# Altium schematic sheet Digital Port L.SchDoc: Port L Digital Control
size A4
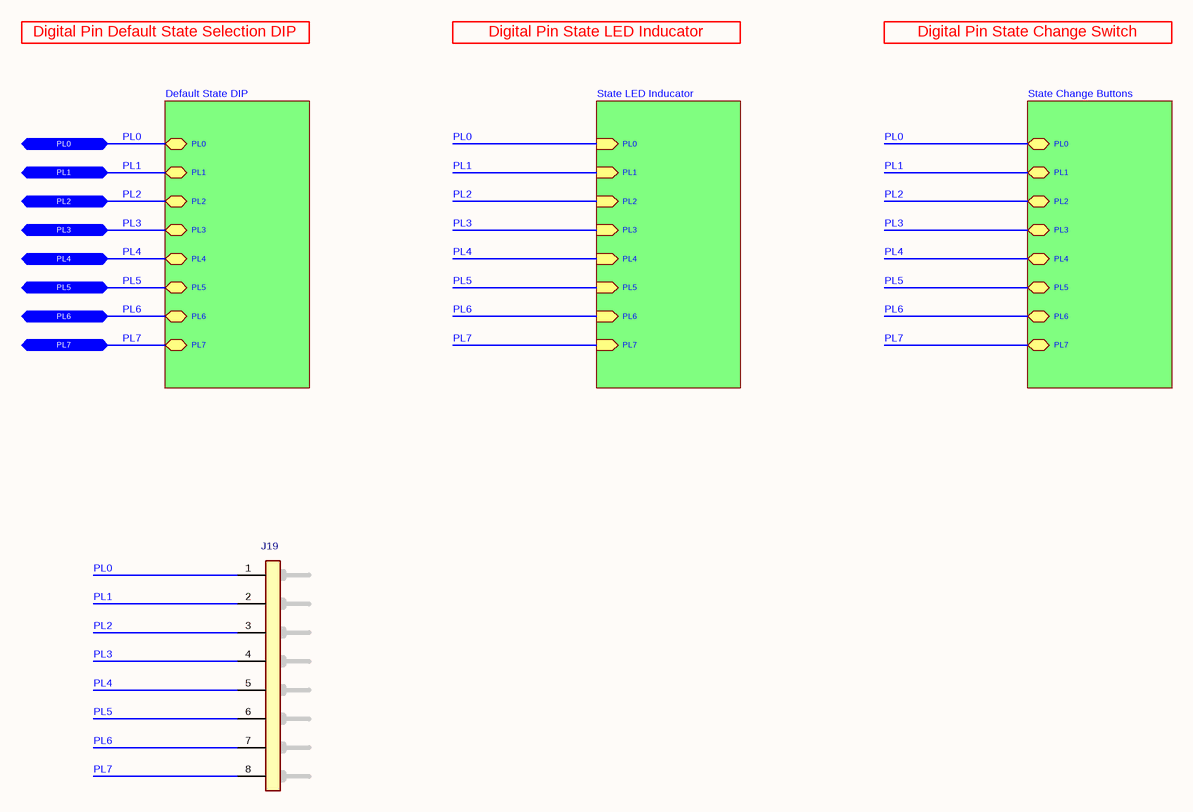
[diagram p0: Digital Port L.SchDoc]

## Parts
J19  2.54 mm Pitch 8P Male Connector  [8P Header]  (value not drawn)

## Sub-sheets
Default State DIP = Digital Port L Default State DIP.SchDoc: PL1 (bidir), PL0 (bidir), PL7 (bidir), PL4 (bidir), PL6 (bidir), PL3 (bidir), PL5 (bidir), PL2 (bidir)
State Change Buttons = Digital Port L Button.SchDoc: PL1 (bidir), PL0 (bidir), PL7 (bidir), PL4 (bidir), PL6 (bidir), PL3 (bidir), PL5 (bidir), PL2 (bidir)
State LED Inducator = Digital Port L State LED Inducator.SchDoc: PL1 (in), PL0 (in), PL7 (in), PL4 (in), PL6 (in), PL3 (in), PL5 (in), PL2 (in)

## Ports
PL0 (bidir), PL1 (bidir), PL2 (bidir), PL3 (bidir), PL4 (bidir), PL5 (bidir), PL6 (bidir), PL7 (bidir)

## Nets
PL0: J19.1(Pin-1) ; port PL0, sheet Default State DIP/PL0, sheet State LED Inducator/PL0, sheet State Change Buttons/PL0
PL1: J19.2(Pin-2) ; port PL1, sheet Default State DIP/PL1, sheet State LED Inducator/PL1, sheet State Change Buttons/PL1
PL2: J19.3(Pin-3) ; port PL2, sheet Default State DIP/PL2, sheet State LED Inducator/PL2, sheet State Change Buttons/PL2
PL3: J19.4(Pin-4) ; port PL3, sheet Default State DIP/PL3, sheet State LED Inducator/PL3, sheet State Change Buttons/PL3
PL4: J19.5(Pin-5) ; port PL4, sheet Default State DIP/PL4, sheet State LED Inducator/PL4, sheet State Change Buttons/PL4
PL5: J19.6(Pin-6) ; port PL5, sheet Default State DIP/PL5, sheet State LED Inducator/PL5, sheet State Change Buttons/PL5
PL6: J19.7(Pin-7) ; port PL6, sheet Default State DIP/PL6, sheet State LED Inducator/PL6, sheet State Change Buttons/PL6
PL7: J19.8(Pin-8) ; port PL7, sheet Default State DIP/PL7, sheet State LED Inducator/PL7, sheet State Change Buttons/PL7

## Notes on the sheet
- Digital Pin Default State Selection DIP
- Digital Pin State LED Inducator
- Digital Pin State Change Switch
- Title
- Size:
- Date:
- A4
- Number:
- Time:
- Revision:
- Sheet
- of
- File:

## Library data of the parts
J19 = Connector - Male Header 8P (2.54): Headers & Wire Housings BREAKAWAY HDR VERT 8; Manufacturer Name: Molex; Position: 8; Row: 1; Pitch: 2.54 mm; Manufacturer Part Number: 22-28-4083; Mouser Part Number: 538-22-28-4083; ROHS: Yes; ComponentLink1Description: DataSheet; ComponentLink1URL: https://www.mouser.com.tr/datasheet/2/276/0022284063_PCB_HEADERS-228265.pdf; ComponentLink2Description: Mouser; ComponentLink2URL: https://www.mouser.com.tr/ProductDetail/Molex/22-28-4083/?qs=%2Fha2pyFaduguMWEp6M%252Bj0x6fHxUvnRGD%252BIxBoa6MO5w%3D